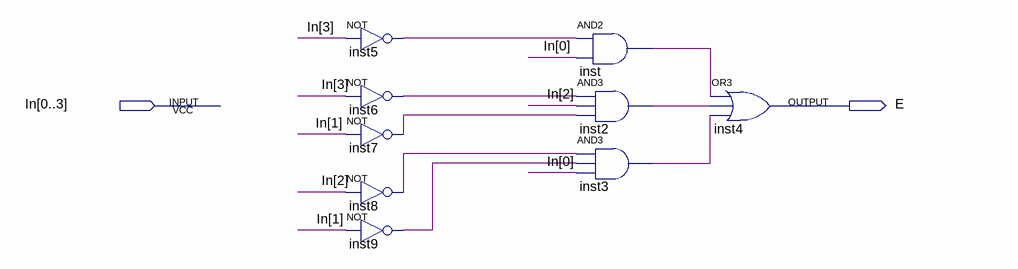
[diagram p0: schematic sheet]
// Quartus schematic display-7.bdf as structural Verilog: 9 symbols, 2 pins
module \display-7  (
  input  [0:3] In,
  output E
);

  wire inst2_out, inst3_out, inst5_out, inst6_out, inst7_out, inst8_out, inst9_out, inst_out;

  not inst5 (inst5_out, In[3]);
  not inst6 (inst6_out, In[3]);
  not inst7 (inst7_out, In[1]);
  not inst8 (inst8_out, In[2]);
  not inst9 (inst9_out, In[1]);
  and inst (inst_out, inst5_out, In[0]);
  and inst2 (inst2_out, inst6_out, In[2], inst7_out);
  and inst3 (inst3_out, inst8_out, inst9_out, In[0]);
  or inst4 (E, inst_out, inst2_out, inst3_out);
endmodule
